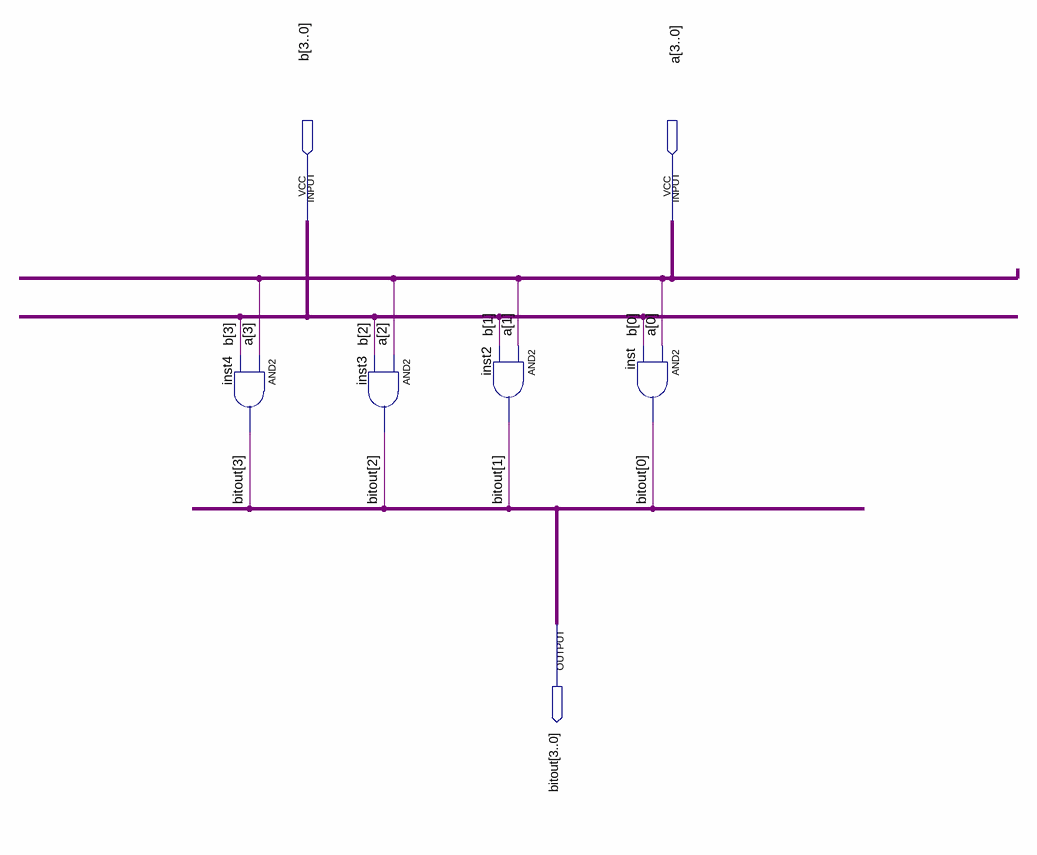
[diagram p0: schematic sheet]
// Quartus schematic bitwise.bdf as structural Verilog: 4 symbols, 3 pins
module bitwise (
  input  [3:0] b,
  input  [3:0] a,
  output [3:0] bitout
);

  and inst4 (bitout[3], a[3], b[3]);
  and inst3 (bitout[2], a[2], b[2]);
  and inst2 (bitout[1], a[1], b[1]);
  and inst (bitout[0], a[0], b[0]);
endmodule
